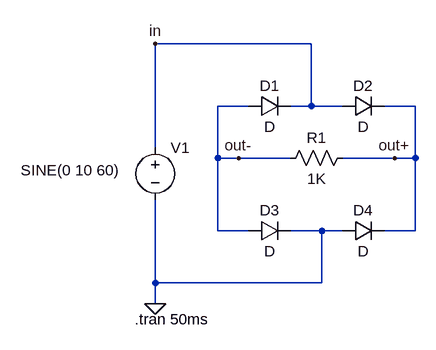
[diagram p0: schematic 2.asc]
2.asc, the LTspice schematic file:
Version 4.1
SHEET 1 880 680
WIRE 192 -32 -48 -32
WIRE 96 64 48 64
WIRE 192 64 192 -32
WIRE 192 64 160 64
WIRE 240 64 192 64
WIRE 352 64 304 64
WIRE -48 128 -48 -32
WIRE 48 144 48 64
WIRE 80 144 48 144
WIRE 160 144 80 144
WIRE 320 144 240 144
WIRE 352 144 352 64
WIRE 352 144 320 144
WIRE 48 256 48 144
WIRE 96 256 48 256
WIRE 208 256 160 256
WIRE 240 256 208 256
WIRE 352 256 352 144
WIRE 352 256 304 256
WIRE -48 336 -48 208
WIRE 208 336 208 256
WIRE 208 336 -48 336
WIRE -48 368 -48 336
FLAG -48 368 0
FLAG 320 144 out+
FLAG 80 144 out-
FLAG -48 -32 in
SYMBOL voltage -48 112 R0
WINDOW 3 -207 51 Left 2
WINDOW 123 0 0 Left 0
WINDOW 39 0 0 Left 0
SYMATTR InstName V1
SYMATTR Value SINE(0 10 60)
SYMBOL diode 96 80 R270
WINDOW 0 32 32 VTop 2
WINDOW 3 0 32 VBottom 2
SYMATTR InstName D1
SYMBOL diode 240 80 R270
WINDOW 0 32 32 VTop 2
WINDOW 3 0 32 VBottom 2
SYMATTR InstName D2
SYMBOL diode 96 272 R270
WINDOW 0 32 32 VTop 2
WINDOW 3 0 32 VBottom 2
SYMATTR InstName D3
SYMBOL diode 240 272 R270
WINDOW 0 32 32 VTop 2
WINDOW 3 0 32 VBottom 2
SYMATTR InstName D4
SYMBOL res 256 128 R90
WINDOW 0 0 56 VBottom 2
WINDOW 3 32 56 VTop 2
SYMATTR InstName R1
SYMATTR Value 1K
TEXT -80 392 Left 2 !.tran 50ms

The netlist it stands for:
* 2.asc
V1 in 0 SINE(0 10 60)
D1 out- in D
D2 in out+ D
D3 out- 0 D
D4 0 out+ D
R1 out+ out- 1K
.model D D
.lib standard.dio
.tran 50ms
.backanno
.end